# EAGLE design SharpIR Filt (EAGLE 6.1)
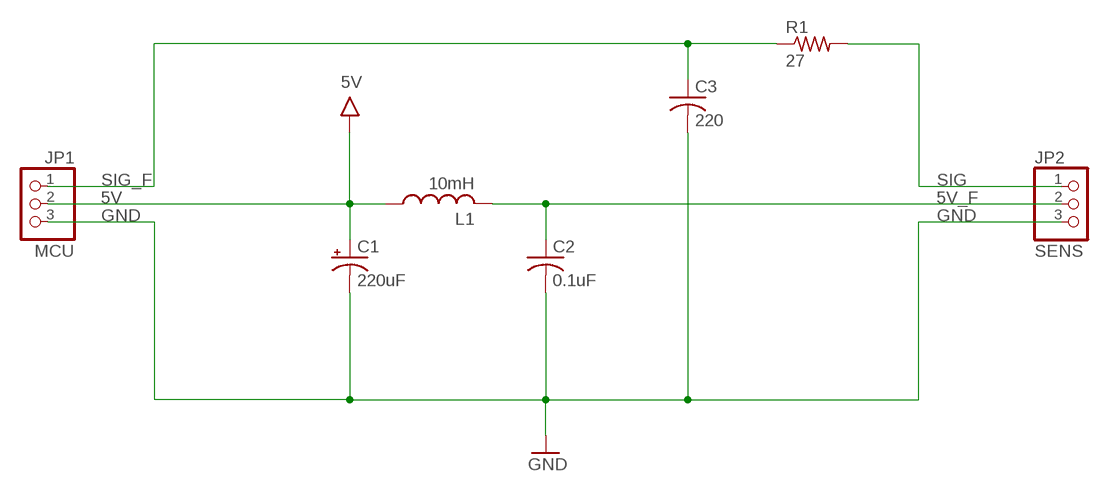
[diagram p0: schematic, sheet 1]

## Parts
C1  220uF  CPOL-USC  [PANASONIC_C]
C2  0.1uF  C-USC0603  [C0603]
C3  220  C-USC0603  [C0603]
JP1  MCU  PINHD-1X03_2.00  [1X03M]
JP2  SENS  PINHD-1X03_2.00  [1X03M]
L1  10mH  L-USL5650M  [L5650M]
R1  27  R-US_R0603  [R0603]

## Nets
5V: C1.+ JP1.2 L1.1
5V_F: C2.1 JP2.2 L1.2
GND: C1.- C2.2 C3.2 JP1.3 JP2.3
SIG: JP2.1 R1.2
SIG_F: C3.1 JP1.1 R1.1

## Library data of the parts
C1 = rcl:CPOL-US: POLARIZED CAPACITOR, American symbol
C2 C3 = rcl:C-US: CAPACITOR, American symbol
JP1 JP2 = pinhead-2:PINHD-1X03: PIN HEADER
L1 = resistor:L-US: INDUCTOR, American symbol
R1 = resistor:R-US_: RESISTOR, American symbol

## Board
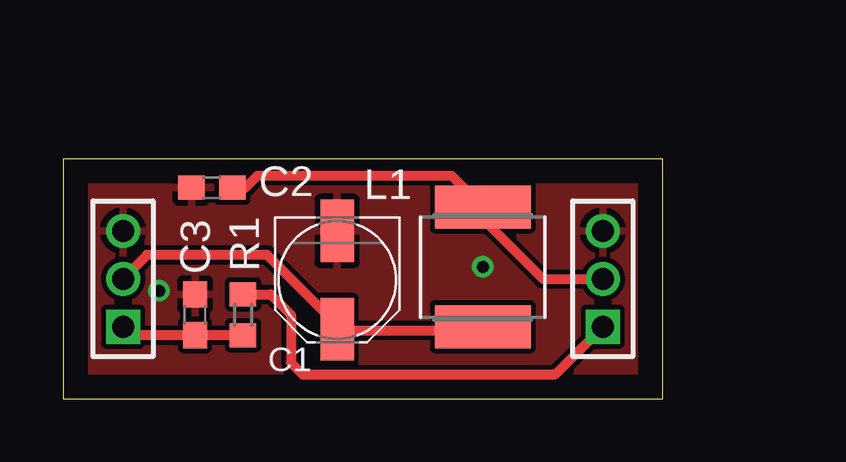
[diagram p1: board, top side]
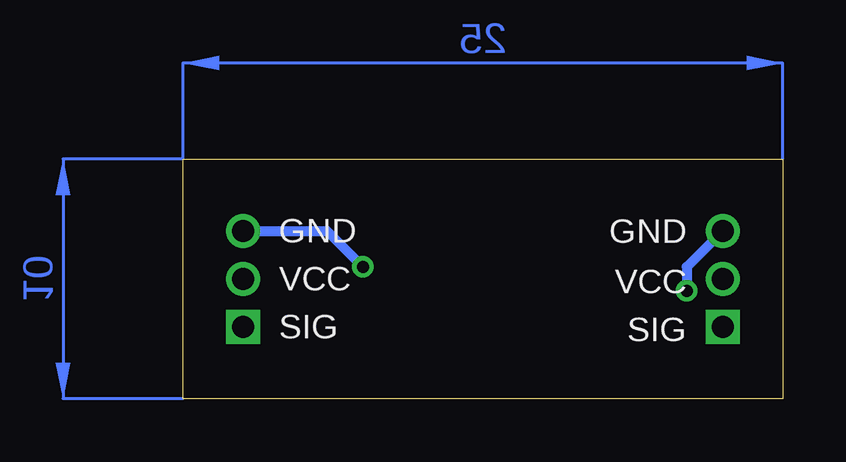
[diagram p2: board, bottom side, seen from below]

Size 25 x 10 mm. Coordinates in mm from the lower left corner, seen from the top.
Outline: 0,0 25,0 25,10 0,10 0,0
Copper layers (1*16): Top 0.035mm / dielectric 1.5mm / Bottom 0.035mm
Design rules: minimum track width 10mil, minimum drill 24mil, track to track 8mil, track to pad 8mil, pad to pad 8mil, via to via 8mil, smd to smd 8mil, copper to edge 40mil, drill to drill 8mil, minimum pad ring 10mil, minimum via ring 8mil, stop-mask expansion 4mil, vias tented up to drill 0mil, thermal gap 10mil

### Footprints (pad centres in the part's own frame; a part is rotated, then mirrored left to right if it is on the bottom)
PANASONIC_C = smd 2.6 x 1.4: + 2.05,0; - -2.05,0
C0603 = smd 1.1 x 1: 1 -0.85,0; 2 0.85,0
1X03M = drill 0.914 square: 1 -2,0 | drill 0.914: 2 0,0; 3 2,0
L5650M = smd 1.8 x 4: 1 -2.5,0; 2 2.5,0
R0603 = smd 1 x 1.1: 1 -0.85,0; 2 0.85,0

### Placement (x,y rotation side)
C1  11.43,4.95 270 top
C2  6.2,8.8 180 top
C3  5.5,3.5 90 top
JP1  2.5,5 90 top
JP2  22.5,5 90 top
L1  17.5,5.5 90 top
R1  7.5,3.5 90 top

### Tracks (layer width: path | path; a pad name or v marks a point on that pad's centre or on a via)
5V
  Top 0.406: JP1.2 3.5,6 8.5,6 11.43,3.07 C1.+ 11.48,2.85 17.35,2.85 L1.1
5V_F
  Top 0.406: C2.1 7.6,8.8 8.1,9.3 16.2,9.3 L1.2 17.5,7.5 20,5 JP2.2
GND  (via drill 0.5)
  Bottom 0.406: JP1.3 4,5.5 v4,4.5 | JP2.3 19,7 v17.5,5.5
  pour Top: -1,11 26,11 26,-1 -1,-1
SIG
  Top 0.406: JP2.1 20.5,1 10,1 9.5,1.5 9.5,3.5 8.65,4.35 R1.2
SIG_F
  Top 0.406: JP1.1 2.85,2.65 C3.1 R1.1
(copper drawn outside any net)
  shapes: Bottom area x2

### Text on the board
bPlace: GND | GND | VCC | VCC | SIG | SIG